# Altium schematic sheet CONN.SchDoc
size B
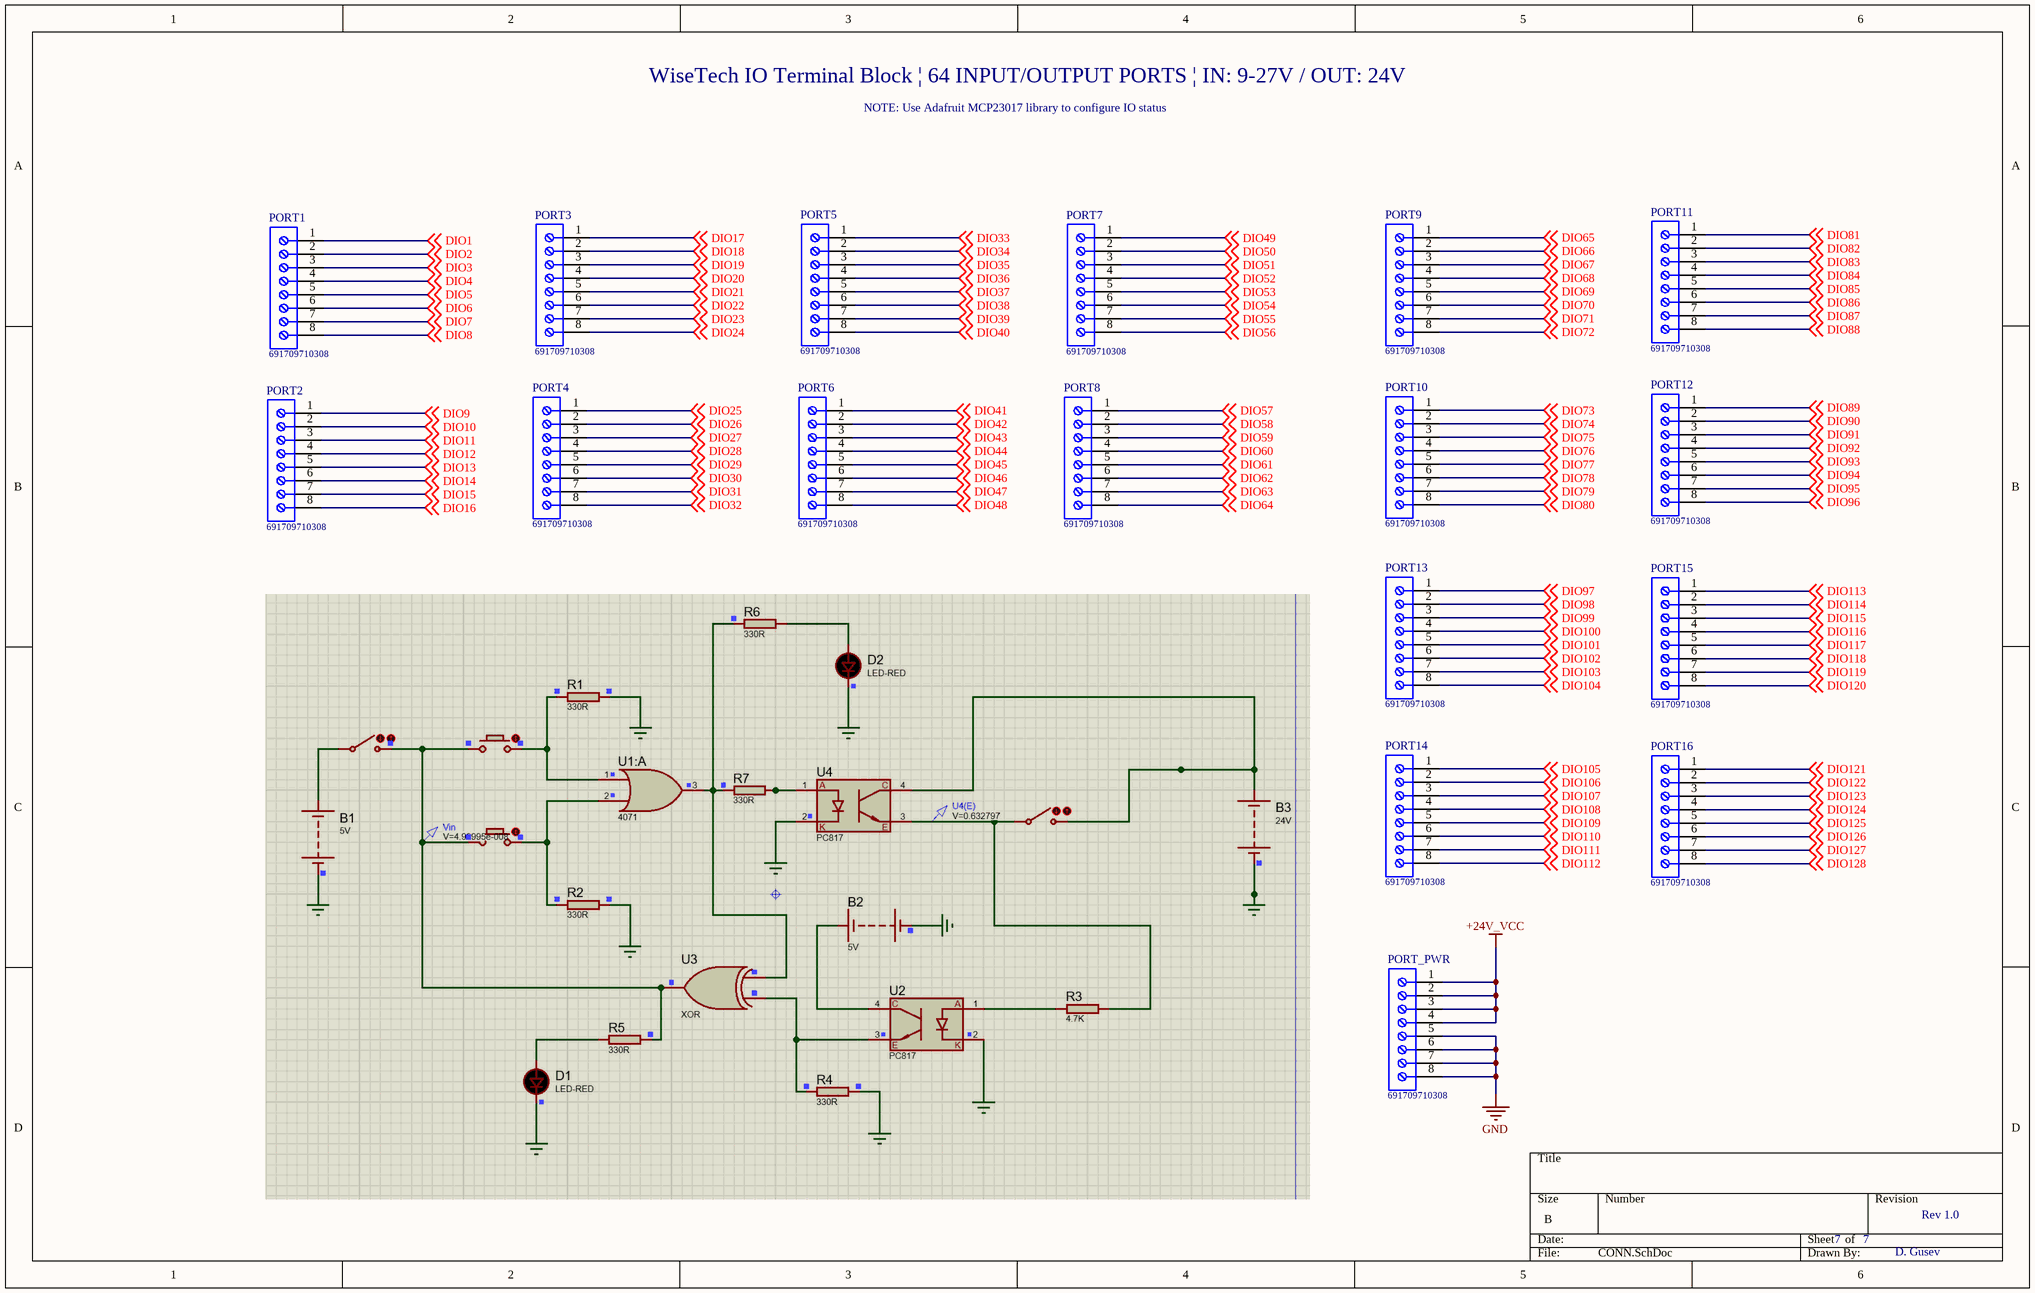
[diagram p0: CONN.SchDoc]

## Parts
PORT1  691709710308  [691709710308]
PORT2  691709710308  [691709710308]
PORT3  691709710308  [691709710308]
PORT4  691709710308  [691709710308]
PORT5  691709710308  [691709710308]
PORT6  691709710308  [691709710308]
PORT7  691709710308  [691709710308]
PORT8  691709710308  [691709710308]
PORT9  691709710308  [691709710308]
PORT10  691709710308  [691709710308]
PORT11  691709710308  [691709710308]
PORT12  691709710308  [691709710308]
PORT13  691709710308  [691709710308]
PORT14  691709710308  [691709710308]
PORT15  691709710308  [691709710308]
PORT16  691709710308  [691709710308]
PORT_PWR  691709710308  [691709710308]

## Nets
+24V_VCC: PORT_PWR.1 PORT_PWR.2 PORT_PWR.3 PORT_PWR.4
GND: PORT_PWR.5 PORT_PWR.6 PORT_PWR.7 PORT_PWR.8
DIO1: PORT1.1 ; off-sheet DIO1
DIO2: PORT1.2 ; off-sheet DIO2
DIO3: PORT1.3 ; off-sheet DIO3
DIO4: PORT1.4 ; off-sheet DIO4
DIO5: PORT1.5 ; off-sheet DIO5
DIO6: PORT1.6 ; off-sheet DIO6
DIO7: PORT1.7 ; off-sheet DIO7
DIO8: PORT1.8 ; off-sheet DIO8
DIO9: PORT2.1 ; off-sheet DIO9
DIO10: PORT2.2 ; off-sheet DIO10
DIO11: PORT2.3 ; off-sheet DIO11
DIO12: PORT2.4 ; off-sheet DIO12
DIO13: PORT2.5 ; off-sheet DIO13
DIO14: PORT2.6 ; off-sheet DIO14
DIO15: PORT2.7 ; off-sheet DIO15
DIO16: PORT2.8 ; off-sheet DIO16
DIO17: PORT3.1 ; off-sheet DIO17
DIO18: PORT3.2 ; off-sheet DIO18
DIO19: PORT3.3 ; off-sheet DIO19
DIO20: PORT3.4 ; off-sheet DIO20
DIO21: PORT3.5 ; off-sheet DIO21
DIO22: PORT3.6 ; off-sheet DIO22
DIO23: PORT3.7 ; off-sheet DIO23
DIO24: PORT3.8 ; off-sheet DIO24
DIO25: PORT4.1 ; off-sheet DIO25
DIO26: PORT4.2 ; off-sheet DIO26
DIO27: PORT4.3 ; off-sheet DIO27
DIO28: PORT4.4 ; off-sheet DIO28
DIO29: PORT4.5 ; off-sheet DIO29
DIO30: PORT4.6 ; off-sheet DIO30
DIO31: PORT4.7 ; off-sheet DIO31
DIO32: PORT4.8 ; off-sheet DIO32
DIO33: PORT5.1 ; off-sheet DIO33
DIO34: PORT5.2 ; off-sheet DIO34
DIO35: PORT5.3 ; off-sheet DIO35
DIO36: PORT5.4 ; off-sheet DIO36
DIO37: PORT5.5 ; off-sheet DIO37
DIO38: PORT5.6 ; off-sheet DIO38
DIO39: PORT5.7 ; off-sheet DIO39
DIO40: PORT5.8 ; off-sheet DIO40
DIO41: PORT6.1 ; off-sheet DIO41
DIO42: PORT6.2 ; off-sheet DIO42
DIO43: PORT6.3 ; off-sheet DIO43
DIO44: PORT6.4 ; off-sheet DIO44
DIO45: PORT6.5 ; off-sheet DIO45
DIO46: PORT6.6 ; off-sheet DIO46
DIO47: PORT6.7 ; off-sheet DIO47
DIO48: PORT6.8 ; off-sheet DIO48
DIO49: PORT7.1 ; off-sheet DIO49
DIO50: PORT7.2 ; off-sheet DIO50
DIO51: PORT7.3 ; off-sheet DIO51
DIO52: PORT7.4 ; off-sheet DIO52
DIO53: PORT7.5 ; off-sheet DIO53
DIO54: PORT7.6 ; off-sheet DIO54
DIO55: PORT7.7 ; off-sheet DIO55
DIO56: PORT7.8 ; off-sheet DIO56
DIO57: PORT8.1 ; off-sheet DIO57
DIO58: PORT8.2 ; off-sheet DIO58
DIO59: PORT8.3 ; off-sheet DIO59
DIO60: PORT8.4 ; off-sheet DIO60
DIO61: PORT8.5 ; off-sheet DIO61
DIO62: PORT8.6 ; off-sheet DIO62
DIO63: PORT8.7 ; off-sheet DIO63
DIO64: PORT8.8 ; off-sheet DIO64
DIO65: PORT9.1 ; off-sheet DIO65
DIO66: PORT9.2 ; off-sheet DIO66
DIO67: PORT9.3 ; off-sheet DIO67
DIO68: PORT9.4 ; off-sheet DIO68
DIO69: PORT9.5 ; off-sheet DIO69
DIO70: PORT9.6 ; off-sheet DIO70
DIO71: PORT9.7 ; off-sheet DIO71
DIO72: PORT9.8 ; off-sheet DIO72
DIO73: PORT10.1 ; off-sheet DIO73
DIO74: PORT10.2 ; off-sheet DIO74
DIO75: PORT10.3 ; off-sheet DIO75
DIO76: PORT10.4 ; off-sheet DIO76
DIO77: PORT10.5 ; off-sheet DIO77
DIO78: PORT10.6 ; off-sheet DIO78
DIO79: PORT10.7 ; off-sheet DIO79
DIO80: PORT10.8 ; off-sheet DIO80
DIO81: PORT11.1 ; off-sheet DIO81
DIO82: PORT11.2 ; off-sheet DIO82
DIO83: PORT11.3 ; off-sheet DIO83
DIO84: PORT11.4 ; off-sheet DIO84
DIO85: PORT11.5 ; off-sheet DIO85
DIO86: PORT11.6 ; off-sheet DIO86
DIO87: PORT11.7 ; off-sheet DIO87
DIO88: PORT11.8 ; off-sheet DIO88
DIO89: PORT12.1 ; off-sheet DIO89
DIO90: PORT12.2 ; off-sheet DIO90
DIO91: PORT12.3 ; off-sheet DIO91
DIO92: PORT12.4 ; off-sheet DIO92
DIO93: PORT12.5 ; off-sheet DIO93
DIO94: PORT12.6 ; off-sheet DIO94
DIO95: PORT12.7 ; off-sheet DIO95
DIO96: PORT12.8 ; off-sheet DIO96
DIO97: PORT13.1 ; off-sheet DIO97
DIO98: PORT13.2 ; off-sheet DIO98
DIO99: PORT13.3 ; off-sheet DIO99
DIO100: PORT13.4 ; off-sheet DIO100
DIO101: PORT13.5 ; off-sheet DIO101
DIO102: PORT13.6 ; off-sheet DIO102
DIO103: PORT13.7 ; off-sheet DIO103
DIO104: PORT13.8 ; off-sheet DIO104
DIO105: PORT14.1 ; off-sheet DIO105
DIO106: PORT14.2 ; off-sheet DIO106
DIO107: PORT14.3 ; off-sheet DIO107
DIO108: PORT14.4 ; off-sheet DIO108
DIO109: PORT14.5 ; off-sheet DIO109
DIO110: PORT14.6 ; off-sheet DIO110
DIO111: PORT14.7 ; off-sheet DIO111
DIO112: PORT14.8 ; off-sheet DIO112
DIO113: PORT15.1 ; off-sheet DIO113
DIO114: PORT15.2 ; off-sheet DIO114
DIO115: PORT15.3 ; off-sheet DIO115
DIO116: PORT15.4 ; off-sheet DIO116
DIO117: PORT15.5 ; off-sheet DIO117
DIO118: PORT15.6 ; off-sheet DIO118
DIO119: PORT15.7 ; off-sheet DIO119
DIO120: PORT15.8 ; off-sheet DIO120
DIO121: PORT16.1 ; off-sheet DIO121
DIO122: PORT16.2 ; off-sheet DIO122
DIO123: PORT16.3 ; off-sheet DIO123
DIO124: PORT16.4 ; off-sheet DIO124
DIO125: PORT16.5 ; off-sheet DIO125
DIO126: PORT16.6 ; off-sheet DIO126
DIO127: PORT16.7 ; off-sheet DIO127
DIO128: PORT16.8 ; off-sheet DIO128

## Notes on the sheet
- WiseTech IO Terminal Block | 64 INPUT/OUTPUT PORTS | IN: 9-27V / OUT: 24V
- NOTE: Use Adafruit MCP23017 library to configure IO status
- 7
- Rev 1.0
- D. Gusev

## Library data of the parts
PORT1-PORT16 PORT_PWR = CMP-1502-03340-1: Serie 7097 - 5.00 mm Horizontal Entry SMT with Pressure Clamp WR-TBL, 8 pin; Manufacturer: Wurth Elektronik; Pin Number: 8; Pitch: 5.00mm; Datasheet URL: http://katalog.we-online.de/em/datasheet/6917097103xx.pdf; Publisher: WurthElektronik; Part Number: 691709710308; Operating Temperature: -45to130degC; Mounting Technology: SMT; Package Reference: 691709710308; Packaging: TapeandReelwithCap; Manufacturer URL: http://www.we-online.de